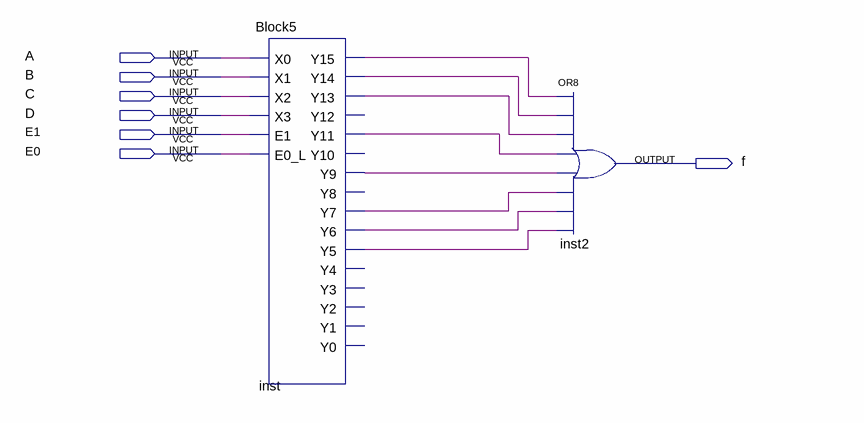
[diagram p0: schematic sheet]
// Quartus schematic DecoderDemo3.bdf as structural Verilog: 2 symbols, 7 pins
module DecoderDemo3 (
  input  A,
  input  B,
  input  C,
  input  D,
  input  E1,
  input  E0,
  output f
);

  wire inst_y5, inst_y6, inst_y7, inst_y9, inst_y11, inst_y13, inst_y14, inst_y15;

  Block5 inst (
    .X0(A), .X1(B), .X2(C), .X3(D), .E1(E1), .E0_L(E0), .Y15(inst_y15), .Y14(inst_y14), .Y13(inst_y13),
    .Y11(inst_y11), .Y9(inst_y9), .Y7(inst_y7), .Y6(inst_y6), .Y5(inst_y5));  // open: Y12, Y10, Y8, Y4, Y3, Y2, Y1, Y0
  or inst2 (f, inst_y15, inst_y14, inst_y13, inst_y11, inst_y9, inst_y7, inst_y6, inst_y5);
endmodule
